# Altium schematic sheet Sheet1.SchDoc
size A4; SheetNumber: 1; SheetTotal: 2
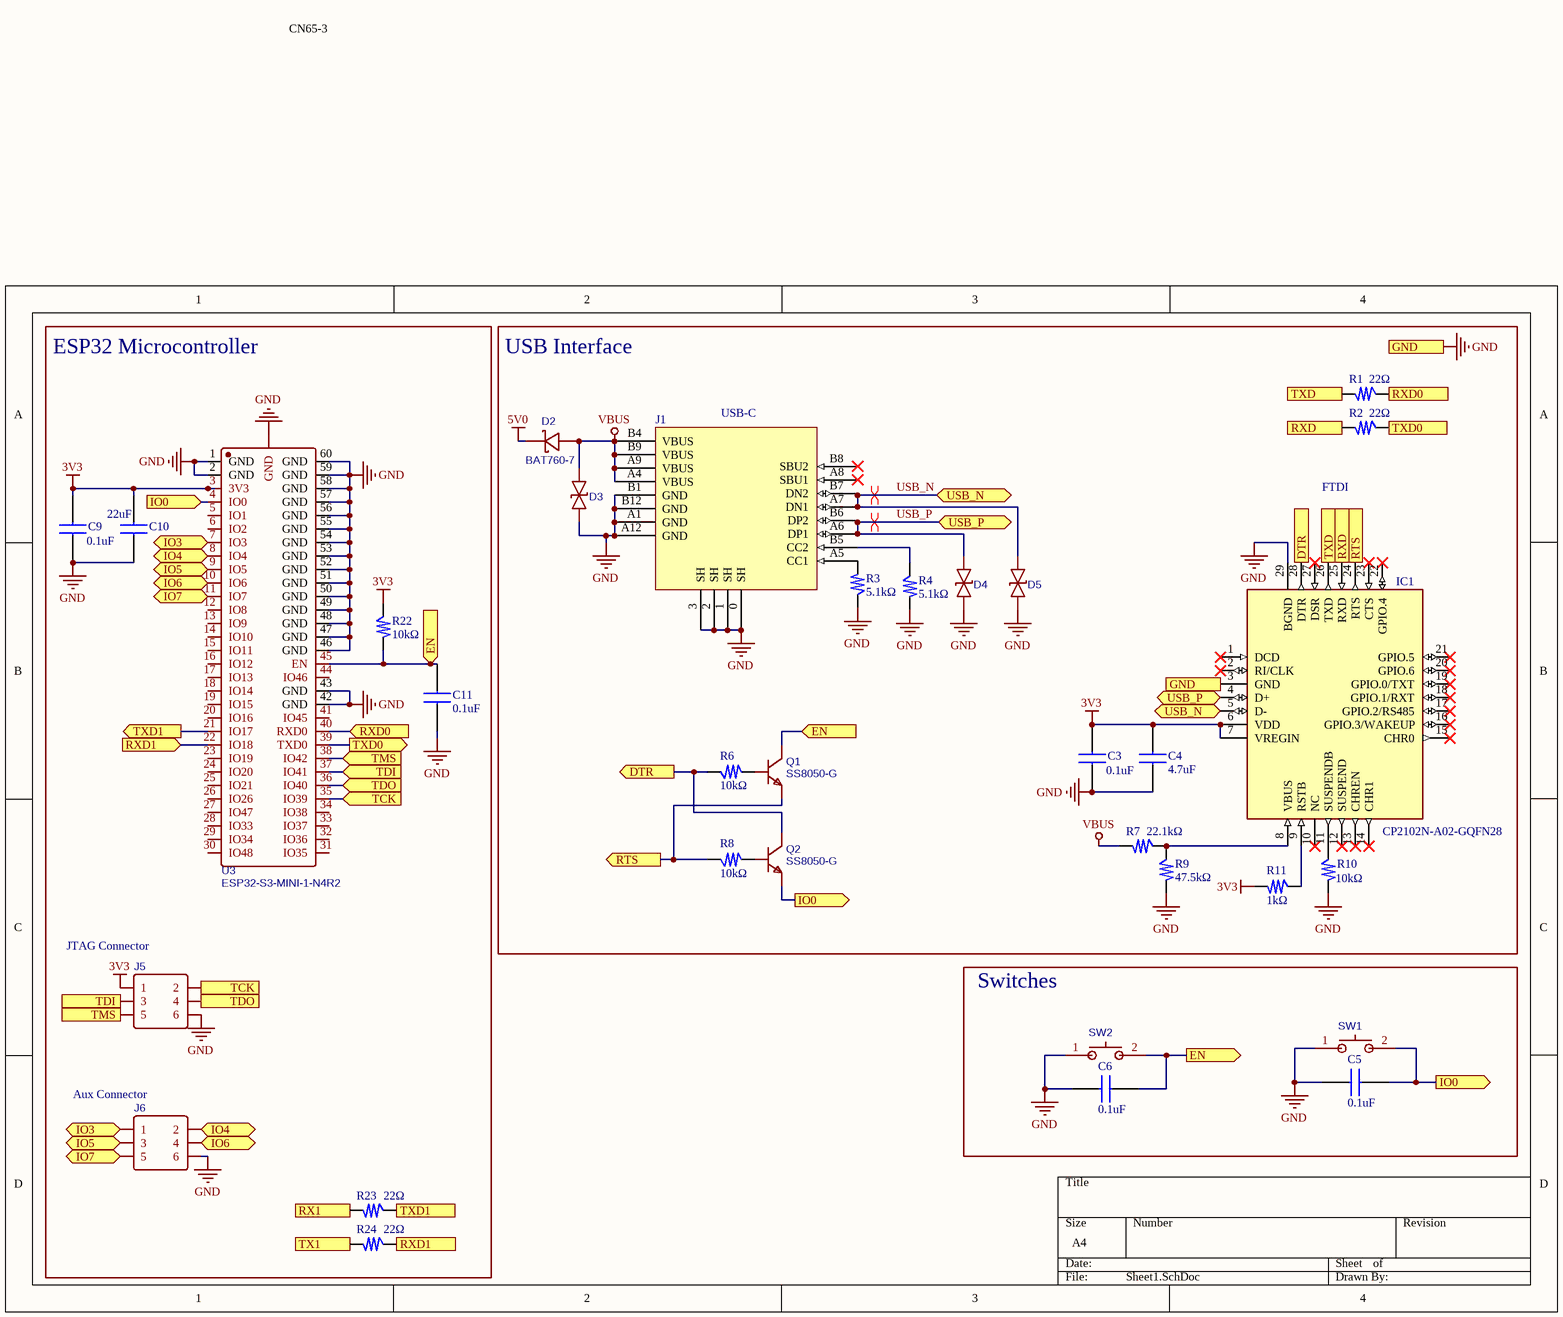
[diagram p0: Sheet1.SchDoc]

## Parts
C3  value 0.1uF  [CAP0608N]  (hidden comment: CAP_0603_0.1UF_20%_50V_X5R)
C4  value 4.7uF  [CAP0608N]  (hidden comment: CAP_0603_4.7UF_20%_10V_X5R)
C5  value 0.1uF  [CAP0608N]  (hidden comment: CAP_0603_0.1UF_20%_50V_X5R)
C6  value 0.1uF  [CAP0608N]  (hidden comment: CAP_0603_0.1UF_20%_50V_X5R)
C9  value 0.1uF  [CAP0608N]  (hidden comment: CAP_0603_0.1UF_20%_50V_X5R)
C10  value 22uF  [CAP0608N]  (hidden comment: CAP0603_22UF_20%_10V_X5R)
C11  value 0.1uF  [CAP0608N]  (hidden comment: CAP_0603_0.1UF_20%_50V_X5R)
D2  BAT760-7  [SOD-323_L1.8-W1.3-LS2.5-RD]
D3  LESD5D5.0CT1G  [SOD-523_L1.2-W0.8-LS1.6-BI]  (value not drawn)
D4  LESD5D5.0CT1G  [SOD-523_L1.2-W0.8-LS1.6-BI]  (value not drawn)
D5  LESD5D5.0CT1G  [SOD-523_L1.2-W0.8-LS1.6-BI]  (value not drawn)
IC1  CP2102N-A02-GQFN28  [QFN50P500X500X80-29N-D]
J1  USB-C  [USBC_SMD_TH]
J5  Header-Male-2.54_2x3  [HDR-TH_6P-P2.54-V-M-R2-C3-S2.54-1]  (value not drawn)
J6  Header-Male-2.54_2x3  [HDR-TH_6P-P2.54-V-M-R2-C3-S2.54-1]  (value not drawn)
Q1  SS8050-G  [SOT-23-3_L2.9-W1.6-P1.90-LS2.8-BR]
Q2  SS8050-G  [SOT-23-3_L2.9-W1.6-P1.90-LS2.8-BR]
R1  value 22Ω  [RES0603N]  (hidden comment: RES_0603_22OHM_0.1W)
R2  value 22Ω  [RES0603N]  (hidden comment: RES_0603_22OHM_0.1W)
R3  value 5.1kΩ  [RES0603N]  (hidden comment: RES_0603_5.1KOHM_0.1W)
R4  value 5.1kΩ  [RES0603N]  (hidden comment: RES_0603_5.1KOHM_0.1W)
R6  value 10kΩ  [RES0603N]  (hidden comment: RES_0603_10KOHM_0.1W)
R7  value 22.1kΩ  [RES0603N]  (hidden comment: RES_0603_22.1KOHM_0.1W)
R8  value 10kΩ  [RES0603N]  (hidden comment: RES_0603_10KOHM_0.1W)
R9  value 47.5kΩ  [RES0603N]  (hidden comment: RES_0603_47.5KOHM_0.1W)
R10  value 10kΩ  [RES0603N]  (hidden comment: RES_0603_10KOHM_0.1W)
R11  value 1kΩ  [RES0603N]  (hidden comment: RES_0603_1KOHM_0.1W)
R22  value 10kΩ  [RES0603N]  (hidden comment: RES_0603_10KOHM_0.1W)
R23  value 22Ω  [RES0603N]  (hidden comment: RES_0603_22OHM_0.1W)
R24  value 22Ω  [RES0603N]  (hidden comment: RES_0603_22OHM_0.1W)
SW1  HX TS342A2P WZ 250GF  [SW-SMD_L4.0-W2.9-LS5.0]  (value not drawn)
SW2  HX TS342A2P WZ 250GF  [SW-SMD_L4.0-W2.9-LS5.0]  (value not drawn)
U3  ESP32-S3-MINI-1-N4R2  [BULETM-SMD_ESP32-S3-MINI-1-N8]

## Blocks framed on the sheet
ESP32 Microcontroller: C9-C11 J5 J6 R22-R24 U3
USB Interface: C3 C4 D2-D5 IC1 J1 Q1 Q2 R1-R4 R6-R11
Switches: C5 C6 SW1 SW2

## Ports
DTR (out), EN (in), EN (out), GND, IO0 (in), IO0 (out), IO3 (bidir), IO4 (bidir), IO5 (bidir), IO6 (bidir), IO7 (bidir), RTS (out), RX1 (out), RXD0 (in), RXD0 (out), RXD1 (in), RXD1 (out), RXD (in), RXD (out), TCK (in), TCK (out), TDI (in), TDI (out), TDO (in), TDO (out), TMS (in), TMS (out), TX1 (in), TXD0 (in), TXD0 (out), TXD1 (in), TXD1 (out), TXD (out), USB_N (bidir), USB_P (bidir)

## Nets
3V3: C3.2 C4.2 C9.2 C10.2 IC1.6(VDD) IC1.7(VREGIN) J5.1 R11.1 R22.2 U3.3(3V3)
5V0: D2.1
GND: C3.1 C4.1 C5.1 C6.1 C9.1 C10.1 C11.2 D3.1 D4.2 D5.2 IC1.3(GND) IC1.29(BGND) J1.0(SH) J1.1(SH) J1.2(SH) J1.3(SH) J1.A1(GND) J1.A12(GND) J1.B1(GND) J1.B12(GND) J5.6 J6.6 R3.2 R4.1 R9.1 R10.1 SW1.1 SW2.1 U3.1(GND) U3.2(GND) U3.42(GND) U3.43(GND) U3.46(GND) U3.47(GND) U3.48(GND) U3.49(GND) U3.50(GND) U3.51(GND) U3.52(GND) U3.53(GND) U3.54(GND) U3.55(GND) U3.56(GND) U3.57(GND) U3.58(GND) U3.59(GND) U3.60(GND) U3.GND ; port GND
VBUS: D2.2 D3.2 J1.A4(VBUS) J1.A9(VBUS) J1.B4(VBUS) J1.B9(VBUS) R7.1
DTR: IC1.28(DTR) Q2.3(C) R6.2 ; port DTR
EN: C6.2 C11.1 Q1.3(C) R22.1 SW2.2 U3.45(EN) ; port EN
IO0: C5.2 Q2.2(E) SW1.2 U3.4(IO0) ; port IO0
IO3: J6.1 U3.7(IO3) ; port IO3
IO4: J6.2 U3.8(IO4) ; port IO4
IO5: J6.3 U3.9(IO5) ; port IO5
IO6: J6.4 U3.10(IO6) ; port IO6
IO7: J6.5 U3.11(IO7) ; port IO7
RTS: IC1.24(RTS) Q1.2(E) R8.2 ; port RTS
RX1: R23.1 ; port RX1
RXD: IC1.25(RXD) R2.1 ; port RXD
RXD0: R1.2 U3.40(RXD0) ; port RXD0
RXD1: R24.2 U3.22(IO18) ; port RXD1
TCK: J5.2 U3.35(IO39) ; port TCK
TDI: J5.3 U3.37(IO41) ; port TDI
TDO: J5.4 U3.36(IO40) ; port TDO
TMS: J5.5 U3.38(IO42) ; port TMS
TX1: R24.1 ; port TX1
TXD: IC1.26(TXD) R1.1 ; port TXD
TXD0: R2.2 U3.39(TXD0) ; port TXD0
TXD1: R23.2 U3.21(IO17) ; port TXD1
USB_N: D5.1 IC1.5(D-) J1.A7(DN1) J1.B7(DN2) ; port USB_N
USB_P: D4.1 IC1.4(D+) J1.A6(DP1) J1.B6(DP2) ; port USB_P
NetIC1_8: IC1.8(VBUS) R7.2 R9.2
NetIC1_9: IC1.9(RSTB) R11.2
NetIC1_11: IC1.11(SUSPENDB) R10.2
NetJ1_A5: J1.A5(CC1) R3.1
NetJ1_B5: J1.B5(CC2) R4.2
NetQ1_1: Q1.1(B) R6.1
NetQ2_1: Q2.1(B) R8.1

Not connected (* = marked no-connect by the designer): IC1 1(DCD)* 2(RI/CLK)* 10(NC)* 12(SUSPEND)* 13(CHREN)* 14(CHR1)* 15(CHR0)* 16(GPIO.3/WAKEUP)* 17(GPIO.2/RS485)* 18(GPIO.1/RXT)* 19(GPIO.0/TXT)* 20(GPIO.6)* 21(GPIO.5)* 22(GPIO.4)* 23(CTS)* 27(DSR)*; J1 A8(SBU1)* B8(SBU2)*; U3 5(IO1) 6(IO2) 12(IO8) 13(IO9) 14(IO10) 15(IO11) 16(IO12) 17(IO13) 18(IO14) 19(IO15) 20(IO16) 23(IO19) 24(IO20) 25(IO21) 26(IO26) 27(IO47) 28(IO33) 29(IO34) 30(IO48) 31(IO35) 32(IO36) 33(IO37) 34(IO38) 41(IO45) 44(IO46)

## Layout directives
differential pair: USB_N, USB_P

## Notes on the sheet
- CN65-3
- FTDI
- (near J5) JTAG Connector
- (near J6) Aux Connector

## Library data of the parts
C3 C5 C6 C9 C11 = CAP_0603_0.1UF_20%_50V_X5R: Condensadores de cerámica multicapa (MLCC- SMD/SMT) 0.1uF+/-20% 50V X5R 0603; Manufacturer_Name: SAMSUNG; Manufacturer_Part_Number: CL10A226MP8NUNE; Geometry.Height: 1.05mm; Mouser Part Number: 187-CL10A226MP8NUNE; Mouser Price/Stock: https://www.mouser.co.uk/ProductDetail/Samsung-Electro-Mechanics/CL10A226MP8NUNE?qs=gRKWieUq2Hb5O0PTfRKzDQ%3D%3D; Datasheet Link: https://datasheet.datasheetarchive.com/originals/distributors/Datasheets-DGA10/2407063.pdf
C4 = CAP_0603_4.7UF_20%_10V_X5R: Condensadores de cerámica multicapa (MLCC- SMD/SMT) 4.7uF+/-20% 10V X5R 0603; Manufacturer_Name: SAMSUNG; Manufacturer_Part_Number: CL10A226MP8NUNE; Geometry.Height: 1.05mm; Mouser Part Number: 187-CL10A226MP8NUNE; Mouser Price/Stock: https://www.mouser.co.uk/ProductDetail/Samsung-Electro-Mechanics/CL10A226MP8NUNE?qs=gRKWieUq2Hb5O0PTfRKzDQ%3D%3D; Datasheet Link: https://datasheet.datasheetarchive.com/originals/distributors/Datasheets-DGA10/2407063.pdf
C10 = CL10A226MP8NUNE: Condensadores de cerámica multicapa (MLCC- SMD/SMT) 22uF+/-20% 10V X5R 0603; Manufacturer_Name: SAMSUNG; Geometry.Height: 1.05mm; Mouser Part Number: 187-CL10A226MP8NUNE; Mouser Price/Stock: https://www.mouser.co.uk/ProductDetail/Samsung-Electro-Mechanics/CL10A226MP8NUNE?qs=gRKWieUq2Hb5O0PTfRKzDQ%3D%3D; Manufacturer_Part_Number: CL10A226MP8NUNE; Datasheet Link: https://datasheet.datasheetarchive.com/originals/distributors/Datasheets-DGA10/2407063.pdf
D2 = BAT760-7: 30V 550mV@1A 1A SOD-323 Schottky Barrier Diodes (SBD) ROHS; Manufacturer: Diodes Incorporated; Contributor: LCSC; Supplier: LCSC; MPN: BAT760-7; Supplier Part: C124187; JLCPCB Part Class: Extended Part; spicePre: D; spiceSymbolName: BAT760-7
D3-D5 = LESD5D5.0CT1G: 5.6V 18.6V 5V Bi-Directional SOD-523 ESD Protection Devices ROHS; Manufacturer: LRC; Contributor: LCSC; Supplier: LCSC; Supplier Part: C383211; MPN: LESD5D5.0CT1G; JLCPCB Part Class: Extended Part; spicePre: D; spiceSymbolName: LESD5D5.0CT1G
IC1 = CP2102N-A02-GQFN28: CI de interfaz USB USBXpress - USB to UART Bridge QFN28; Manufacturer_Name: Silicon Labs; Datasheet Link: https://componentsearchengine.com/Datasheets/2/CP2102N-A02-GQFN28.pdf; Height: 0.8mm; Manufacturer_Part_Number: CP2102N-A02-GQFN28; Mouser Part Number: 634-CP2102NA02GQFN28; Mouser Price/Stock: https://www.mouser.co.uk/ProductDetail/Silicon-Labs/CP2102N-A02-GQFN28?qs=u16ybLDytRaSBkSkyjYFiA%3D%3D; Arrow Part Number: CP2102N-A02-GQFN28; Arrow Price/Stock: https://www.arrow.com/en/products/cp2102n-a02-gqfn28/silicon-labs?region=europe
J1 = USB-C 16PIN CONNECTOR: 3A Surface Mount 16P Female -25℃~+85℃ Type-C SMD USB Connectors ROHS; Manufacturer: Dealon; MPN: USB-TYPE-C-018
J5 J6 = Header-Male-2.54_2x3: Pin Header Straight 6P 2.54mm Black Plugin,P=2.54mm Pin Headers ROHS; Manufacturer: BOOMELE; MPN: 2.54-2*3P针; Supplier: LCSC; Supplier Part: C65114; JLCPCB Part Class: Extended Part; spicePre: J; spiceSymbolName: Header-Male-2.54_2x3
Q1 Q2 = SS8050-G: 25V 300mW 120@100mA,1V 1.5A NPN SOT-23 Bipolar Transistors - BJT ROHS; Manufacturer: Jiangsu Changjing Electronics Technology; Contributor: LCSC; Supplier: LCSC; MPN: SS8050-G; Supplier Part: C164886; JLCPCB Part Class: Extended Part; spicePre: Q; spiceSymbolName: SS8050-G
R1 R2 R23 R24 = RES_0603_22OHM_0.1W: Res Thick Film 0603 22 Ohm 1% 0.1W(1/10W) +/-100ppm/C Epoxy Pad SMD T/R; Manufacturer_Name: YAGEO; Manufacturer_Part_Number: RC0603FR-071KL; MPN: RT0603FRE075K1L; Geometry.Height: 0.55mm; Mouser Part Number: 603-RC0603FR-071KL; Mouser Price/Stock: https://www.mouser.co.uk/ProductDetail/YAGEO/RC0603FR-071KL?qs=VU8sRB4EgwApHsk4rF%2F3zg%3D%3D; Datasheet Link: https://www.yageo.com/upload/media/product/productsearch/datasheet/rchip/PYu-RC_Group_51_RoHS_L_12.pdf; Manufacturer: Yageo
R3 R4 = RES_0603_5.1KOHM_0.1W: Res Thick Film 0603 5.1K Ohm 1% 0.1W(1/10W) +/-100ppm/C Epoxy Pad SMD T/R; Manufacturer_Name: YAGEO; Manufacturer_Part_Number: RC0603FR-071KL; MPN: RT0603FRE075K1L; Geometry.Height: 0.55mm; Mouser Part Number: 603-RC0603FR-071KL; Mouser Price/Stock: https://www.mouser.co.uk/ProductDetail/YAGEO/RC0603FR-071KL?qs=VU8sRB4EgwApHsk4rF%2F3zg%3D%3D; Datasheet Link: https://www.yageo.com/upload/media/product/productsearch/datasheet/rchip/PYu-RC_Group_51_RoHS_L_12.pdf; Manufacturer: Yageo
R6 R8 R10 R22 = RES_0603_10KOHM_0.1W: Res Thick Film 0603 10K Ohm 1% 0.1W(1/10W) +/-100ppm/C Epoxy Pad SMD T/R; Manufacturer_Name: YAGEO; Manufacturer_Part_Number: RC0603FR-071KL; MPN: RT0603FRE075K1L; Geometry.Height: 0.55mm; Mouser Part Number: 603-RC0603FR-071KL; Mouser Price/Stock: https://www.mouser.co.uk/ProductDetail/YAGEO/RC0603FR-071KL?qs=VU8sRB4EgwApHsk4rF%2F3zg%3D%3D; Datasheet Link: https://www.yageo.com/upload/media/product/productsearch/datasheet/rchip/PYu-RC_Group_51_RoHS_L_12.pdf; Manufacturer: Yageo
R7 = RES_0603_22.1KOHM_0.1W: Res Thick Film 0603 22.1K Ohm 1% 0.1W(1/10W) +/-100ppm/C Epoxy Pad SMD T/R; Manufacturer_Name: YAGEO; Manufacturer_Part_Number: RC0603FR-071KL; MPN: RT0603FRE075K1L; Geometry.Height: 0.55mm; Mouser Part Number: 603-RC0603FR-071KL; Mouser Price/Stock: https://www.mouser.co.uk/ProductDetail/YAGEO/RC0603FR-071KL?qs=VU8sRB4EgwApHsk4rF%2F3zg%3D%3D; Datasheet Link: https://www.yageo.com/upload/media/product/productsearch/datasheet/rchip/PYu-RC_Group_51_RoHS_L_12.pdf; Manufacturer: Yageo
R9 = RES_0603_47.5KOHM_0.1W: Res Thick Film 0603 47.5K Ohm 1% 0.1W(1/10W) +/-100ppm/C Epoxy Pad SMD T/R; Manufacturer_Name: YAGEO; Manufacturer_Part_Number: RC0603FR-071KL; MPN: RT0603FRE075K1L; Geometry.Height: 0.55mm; Mouser Part Number: 603-RC0603FR-071KL; Mouser Price/Stock: https://www.mouser.co.uk/ProductDetail/YAGEO/RC0603FR-071KL?qs=VU8sRB4EgwApHsk4rF%2F3zg%3D%3D; Datasheet Link: https://www.yageo.com/upload/media/product/productsearch/datasheet/rchip/PYu-RC_Group_51_RoHS_L_12.pdf; Manufacturer: Yageo
R11 = RES_0603_1KOHM_0.1W: Res Thick Film 0603 1K Ohm 1% 0.1W(1/10W) +/-100ppm/C Epoxy Pad SMD T/R; Manufacturer_Name: YAGEO; Manufacturer_Part_Number: RC0603FR-071KL; Geometry.Height: 0.55mm; Mouser Part Number: 603-RC0603FR-071KL; Mouser Price/Stock: https://www.mouser.co.uk/ProductDetail/YAGEO/RC0603FR-071KL?qs=VU8sRB4EgwApHsk4rF%2F3zg%3D%3D; Datasheet Link: https://www.yageo.com/upload/media/product/productsearch/datasheet/rchip/PYu-RC_Group_51_RoHS_L_12.pdf; MPN: RC0603FR-071KL; Manufacturer: Yageo
SW1 SW2 = HX TS342A2P WZ 250GF: SMD Tactile Switches ROHS; Manufacturer: Hanxia; Contributor: lcsc; Supplier: LCSC; Supplier Part: C5143624; MPN: HX TS342A2P WZ 250gf; JLCPCB Part Class: Extended Part; spicePre: S; spiceSymbolName: HX TS342A2P WZ 250GF
U3 = ESP32-S3-MINI-1-N4R2: ESP32-S3 Mini SMD WiFi Modules ROHS; Manufacturer: ESPRESSIF; Contributor: lcsc; Supplier: LCSC; Supplier Part: C3013941; MPN: ESP32-S3-MINI-1-N4R2; JLCPCB Part Class: Extended Part; spicePre: U; spiceSymbolName: ESP32-S3-MINI-1-N4R2